# EAGLE board fpga (EAGLE 6.6.0)
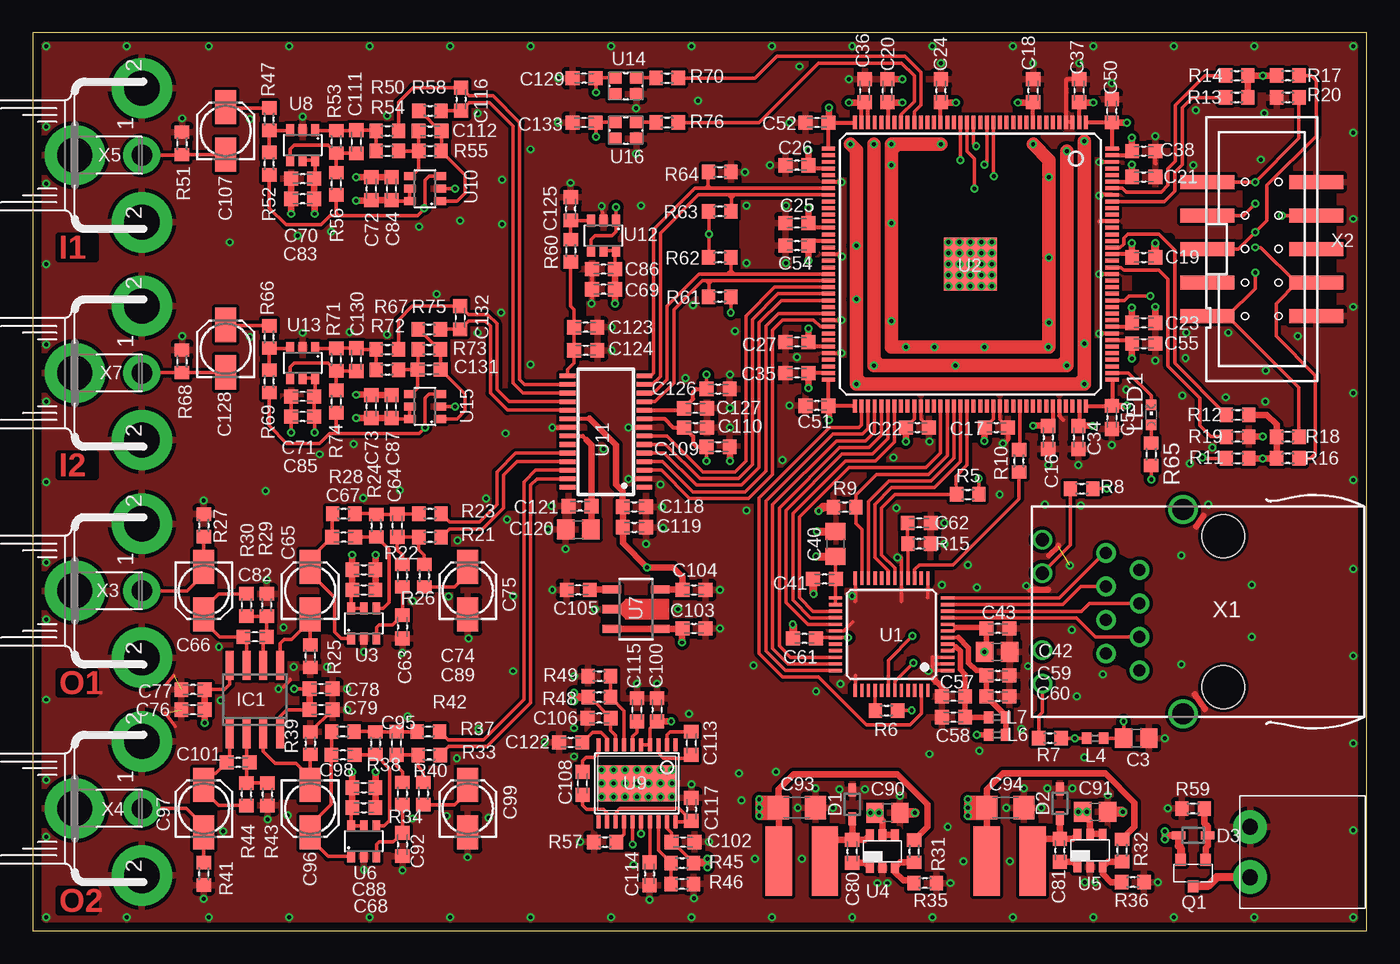
[diagram p2: board, top side]
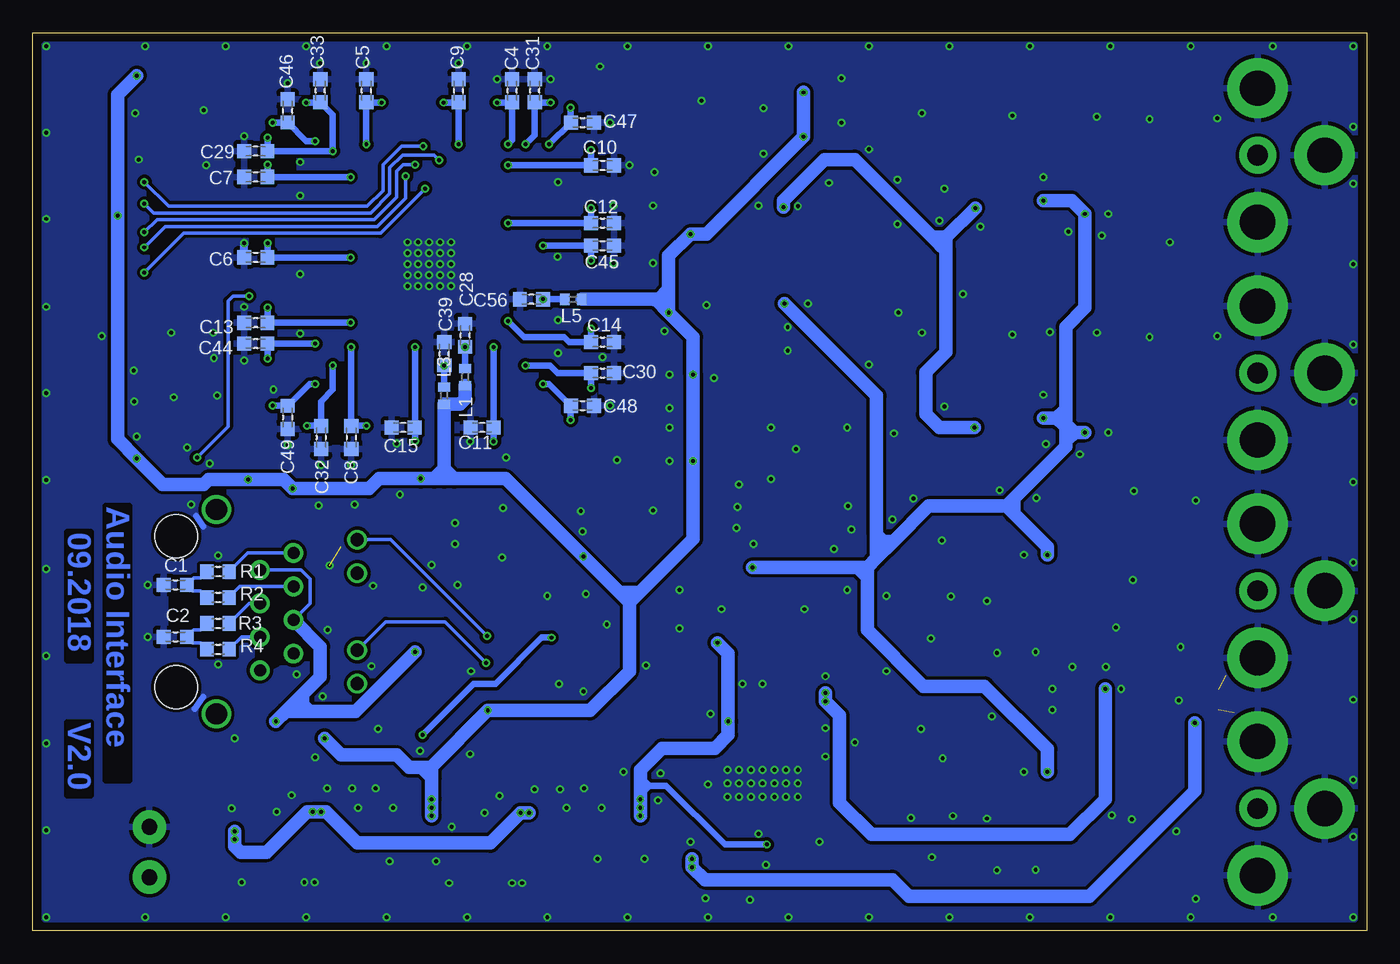
[diagram p3: board, bottom side, seen from below]

Size 101.09 x 68.07 mm. Coordinates in mm from the lower left corner, seen from the top.
Outline: 0,0 101.09,0 101.09,68.07 0,68.07 0,0
Copper layers (1*16): Top 0.035mm / dielectric 1.5mm / Bottom 0.035mm
Design rules "PCB-POOL Standard *": minimum track width 0.15mm, minimum drill 0.3mm, track to track 0.1mm, track to pad 0.1mm, pad to pad 0.1mm, via to via 0.1mm, smd to smd 0.1mm, copper to edge 0.2mm, drill to drill 0.2mm, minimum pad ring 0.2mm, minimum via ring 0.15mm, stop-mask expansion 0.075mm, vias tented up to drill 0.3mm, thermal gap 0.3mm
tRestrict: area 62.8,5.3 to 66,6.7; area 66.5,7.7 to 67.3,9.6; area 78.6,5.5 to 81.9,6.8; area 82.1,7.9 to 82.9,9.8; area 69,18.4 to 69.7,20.8; area 62.2,17.7 to 62.8,18.5; area 62.1,26.4 to 67.9,27.2; area 57.2,21.8 to 57.8,23.7; area 58.5,24.6 to 60.3,32.4; area 61.7,27.7 to 62.8,30.7; area 83.7,46.3 to 86.2,52.6; area 19.2,53.8 to 20.7,56.3; 33 more areas
bRestrict: area 77.4,37.2 to 78.8,41; area 88.8,23.2 to 90.4,25.3; area 83.4,51.6 to 84.3,52.6; area 81.5,57.7 to 82.4,58.7; area 81.3,19.7 to 83.9,22.3

## Footprints (pad centres in the part's own frame; a part is rotated, then mirrored left to right if it is on the bottom)
C0603K = smd 1.05 x 1.08: 1 -0.875,0; 2 0.875,0
C0805 = smd 1.3 x 1.5: 1 -0.95,0; 2 0.95,0
153CLV-0405 = smd 2.6 x 1.6: + 1.8,0; - -1.8,0
C1206 = smd 1.6 x 1.8: 1 -1.4,0; 2 1.4,0
SOD323 = smd 1 x 0.6: 1 -1.1,0; 2 1.1,0
SO08 = smd 0.6 x 2.2: 1 -1.905,-2.6; 2 -0.635,-2.6; 3 0.635,-2.6; 4 1.905,-2.6; 5 1.905,2.6; 6 0.635,2.6; 7 -0.635,2.6; 8 -1.905,2.6
0402 = smd 0.7 x 0.9: 1 -0.65,0; 2 0.65,0
AAA = smd 2 x 5.3: P$1 -2,1; P$2 1.5,1
CHIPLED_0603 = smd 0.8 x 0.8: A 0,-0.75; C 0,0.75
MICRO3 = smd 0.8 x 0.9: 1 -0.95,-1; 2 0.95,-1; 3 0,1
R0603 = smd 1 x 1.1: 1 -0.85,0; 2 0.85,0
TQFP48 = smd 0.25 x 1: 1 -2.75,-4.25; 2 -2.25,-4.25; 3 -1.75,-4.25; 4 -1.25,-4.25; 5 -0.75,-4.25; 6 -0.25,-4.25; 7 0.25,-4.25; 8 0.75,-4.25; 9 1.25,-4.25; 10 1.75,-4.25; 11 2.25,-4.25; 12 2.75,-4.25; 25 2.75,4.25; 26 2.25,4.25; 27 1.75,4.25; 28 1.25,4.25; 29 0.75,4.25; 30 0.25,4.25; 31 -0.25,4.25; 32 -0.75,4.25; 33 -1.25,4.25; 34 -1.75,4.25; 35 -2.25,4.25; 36 -2.75,4.25 | smd 1 x 0.25: 13 4.25,-2.75; 14 4.25,-2.25; 15 4.25,-1.75; 16 4.25,-1.25; 17 4.25,-0.75; 18 4.25,-0.25; 19 4.25,0.25; 20 4.25,0.75; 21 4.25,1.25; 22 4.25,1.75; 23 4.25,2.25; 24 4.25,2.75; 37 -4.25,2.75; 38 -4.25,2.25; 39 -4.25,1.75; 40 -4.25,1.25; 41 -4.25,0.75; 42 -4.25,0.25; 43 -4.25,-0.25; 44 -4.25,-0.75; 45 -4.25,-1.25; 46 -4.25,-1.75; 47 -4.25,-2.25; 48 -4.25,-2.75
EQFP144 = smd 1 x 0.3: 1 -10.75,8.75; 2 -10.75,8.25; 3 -10.75,7.75; 4 -10.75,7.25; 5 -10.75,6.75; 6 -10.75,6.25; 7 -10.75,5.75; 8 -10.75,5.25; 9 -10.75,4.75; 10 -10.75,4.25; 11 -10.75,3.75; 12 -10.75,3.25; 13 -10.75,2.75; 14 -10.75,2.25; 15 -10.75,1.75; 16 -10.75,1.25; 17 -10.75,0.75; 18 -10.75,0.25; 19 -10.75,-0.25; 20 -10.75,-0.75; 21 -10.75,-1.25; 22 -10.75,-1.75; 23 -10.75,-2.25; 24 -10.75,-2.75; 25 -10.75,-3.25; 26 -10.75,-3.75; 27 -10.75,-4.25; 28 -10.75,-4.75; 29 -10.75,-5.25; 30 -10.75,-5.75; 31 -10.75,-6.25; 32 -10.75,-6.75; 33 -10.75,-7.25; 34 -10.75,-7.75; 35 -10.75,-8.25; 36 -10.75,-8.75; 73 10.75,-8.75; 74 10.75,-8.25; 75 10.75,-7.75; 76 10.75,-7.25; 77 10.75,-6.75; 78 10.75,-6.25; 79 10.75,-5.75; 80 10.75,-5.25; 81 10.75,-4.75; 82 10.75,-4.25; 83 10.75,-3.75; 84 10.75,-3.25; 85 10.75,-2.75; 86 10.75,-2.25; 87 10.75,-1.75; 88 10.75,-1.25; 89 10.75,-0.75; 90 10.75,-0.25; 91 10.75,0.25; 92 10.75,0.75; 93 10.75,1.25; 94 10.75,1.75; 95 10.75,2.25; 96 10.75,2.75; 97 10.75,3.25; 98 10.75,3.75; 99 10.75,4.25; 100 10.75,4.75; 101 10.75,5.25; 102 10.75,5.75; 103 10.75,6.25; 104 10.75,6.75; 105 10.75,7.25; 106 10.75,7.75; 107 10.75,8.25; 108 10.75,8.75 | smd 0.3 x 1: 37 -8.75,-10.75; 38 -8.25,-10.75; 39 -7.75,-10.75; 40 -7.25,-10.75; 41 -6.75,-10.75; 42 -6.25,-10.75; 43 -5.75,-10.75; 44 -5.25,-10.75; 45 -4.75,-10.75; 46 -4.25,-10.75; 47 -3.75,-10.75; 48 -3.25,-10.75; 49 -2.75,-10.75; 50 -2.25,-10.75; 51 -1.75,-10.75; 52 -1.25,-10.75; 53 -0.75,-10.75; 54 -0.25,-10.75; 55 0.25,-10.75; 56 0.75,-10.75; 57 1.25,-10.75; 58 1.75,-10.75; 59 2.25,-10.75; 60 2.75,-10.75; 61 3.25,-10.75; 62 3.75,-10.75; 63 4.25,-10.75; 64 4.75,-10.75; 65 5.25,-10.75; 66 5.75,-10.75; 67 6.25,-10.75; 68 6.75,-10.75; 69 7.25,-10.75; 70 7.75,-10.75; 71 8.25,-10.75; 72 8.75,-10.75; 109 8.75,10.75; 110 8.25,10.75; 111 7.75,10.75; 112 7.25,10.75; 113 6.75,10.75; 114 6.25,10.75; 115 5.75,10.75; 116 5.25,10.75; 117 4.75,10.75; 118 4.25,10.75; 119 3.75,10.75; 120 3.25,10.75; 121 2.75,10.75; 122 2.25,10.75; 123 1.75,10.75; 124 1.25,10.75; 125 0.75,10.75; 126 0.25,10.75; 127 -0.25,10.75; 128 -0.75,10.75; 129 -1.25,10.75; 130 -1.75,10.75; 131 -2.25,10.75; 132 -2.75,10.75; 133 -3.25,10.75; 134 -3.75,10.75; 135 -4.25,10.75; 136 -4.75,10.75; 137 -5.25,10.75; 138 -5.75,10.75; 139 -6.25,10.75; 140 -6.75,10.75; 141 -7.25,10.75; 142 -7.75,10.75; 143 -8.25,10.75; 144 -8.75,10.75 | smd 4 x 4: E 0,0
SOT23-6 = smd 0.6 x 0.9: 1 -0.95,-1.15; 2 0,-1.15; 3 0.95,-1.15; 4 0.95,1.15; 5 0,1.15; 6 -0.95,1.15
TSOT23-6_DDC = smd 0.6 x 0.8: 1 -0.95,-1.25; 2 0,-1.25; 3 0.95,-1.25; 4 0.95,1.25; 5 0,1.25; 6 -0.95,1.25
SOT89-5 = smd 0.6 x 1.4: 1 -1.499,-1.781; 3 1.499,-1.781; 4 1.499,1.894; 5 -1.499,1.894 | smd 0.65 x 1.4: 2 0,-1.781
TSSOP20_GND = smd 0.305 x 0.991: 1 -2.925,-2.918; 2 -2.275,-2.918; 3 -1.625,-2.918; 4 -0.975,-2.918; 5 -0.325,-2.918; 6 0.325,-2.918; 7 0.975,-2.918; 8 1.625,-2.918; 9 2.275,-2.918; 10 2.925,-2.918; 11 2.925,2.918; 12 2.275,2.918; 13 1.625,2.918; 14 0.975,2.918; 15 0.325,2.918; 16 -0.325,2.918; 17 -0.975,2.918; 18 -1.625,2.918; 19 -2.275,2.918; 20 -2.925,2.918 | smd 6.071 x 2.743: GND 0,0
TSSOP28 = smd 0.35 x 1.2: 1 -4.225,-2.9; 2 -3.575,-2.9; 3 -2.925,-2.9; 4 -2.275,-2.9; 5 -1.625,-2.9; 6 -0.975,-2.9; 7 -0.325,-2.9; 8 0.325,-2.9; 9 0.975,-2.9; 10 1.625,-2.9; 11 2.275,-2.9; 12 2.925,-2.9; 13 3.575,-2.9; 14 4.225,-2.9; 15 4.225,2.9; 16 3.575,2.9; 17 2.925,2.9; 18 2.275,2.9; 19 1.625,2.9; 20 0.975,2.9; 21 0.325,2.9; 22 -0.325,2.9; 23 -0.975,2.9; 24 -1.625,2.9; 25 -2.275,2.9; 26 -2.925,2.9; 27 -3.575,2.9; 28 -4.225,2.9
OSC = smd 1 x 0.9: 1 0,0; 2 1.625,0; 3 1.625,1.225; 4 0,1.225
SI-50170 = drill 0.9 pad 1.5: 1 4.445,5.842; 2 3.175,3.302; 3 1.905,5.842; 4 0.635,3.302; 5 -0.635,5.842; 6 -1.905,3.302; 7 -3.175,5.842; 8 -4.445,3.302 | drill 1.016 pad 1.5: A1 -5.461,10.668; A2 2.921,10.668; C1 -2.921,10.668; C2 5.461,10.668 | drill 1.6 pad 2.2: S1 -7.747,0; S2 7.747,0 | hole 3.251: -5.715,-3.048; 5.715,-3.048
PAK100/2500-10 = smd 1.067 x 4.064: 1 -5.08,-4.128; 2 -5.08,4.128; 3 -2.54,-4.128; 4 -2.54,4.128; 5 0,-4.128; 6 0,4.128; 7 2.54,-4.128; 8 2.54,4.128; 9 5.08,-4.128; 10 5.08,4.128
RCA = drill 2.667 pad 4.572: GND1 -5.08,0; GND2 5.08,0; GND3 0,5.08 | drill 1.575 pad 2.794: S1 0,0
2 = drill 1.2 pad 2.54: P$1 -1.905,0; P$2 1.905,0

## Placement (x,y rotation side)
C1  100n  [C0603K]  90.3,26.23 0 bottom
C2  100n  [C0603K]  90.3,22.29 0 bottom
C3  10u  [C0805]  83.63,14.61 0 top
C4  100n  [C0603K]  64.77,63.69 90 bottom
C5  100n  [C0603K]  75.82,63.69 90 bottom
C6  100n  [C0603K]  84.2,51.05 180 bottom
C7  100n  [C0603K]  84.2,57.15 180 bottom
C8  100n  [C0603K]  76.96,37.4 270 bottom
C9  100n  [C0603K]  68.83,63.69 90 bottom
C10  100n  [C0603K]  57.91,58.04 0 bottom
C11  100n  [C0603K]  67.06,38.16 180 bottom
C12  100n  [C0603K]  57.91,53.66 0 bottom
C13  100n  [C0603K]  84.2,46.1 180 bottom
C14  100n  [C0603K]  57.91,44.64 0 bottom
C15  100n  [C0603K]  73.03,38.16 180 bottom
C16  1u  [C0603K]  76.96,37.4 270 top
C17  1u  [C0603K]  73.03,38.16 0 top
C18  1u  [C0603K]  75.82,63.69 90 top
C19  1u  [C0603K]  84.2,51.05 0 top
C20  1u  [C0603K]  64.77,63.69 90 top
C21  1u  [C0603K]  84.2,57.15 0 top
C22  1u  [C0603K]  67.06,38.16 0 top
C23  1u  [C0603K]  84.2,46.1 0 top
C24  1u  [C0603K]  68.83,63.69 90 top
C25  1u  [C0603K]  57.91,53.66 180 top
C26  1u  [C0603K]  57.91,58.04 180 top
C27  1u  [C0603K]  57.91,44.64 180 top
C28  10u  [C0603K]  68.33,45.15 90 bottom
C29  100n  [C0603K]  84.2,59.12 180 bottom
C30  100n  [C0603K]  57.91,42.29 0 bottom
C31  100n  [C0603K]  63.06,63.69 90 bottom
C32  100n  [C0603K]  79.25,37.4 270 bottom
C33  100n  [C0603K]  79.31,63.69 90 bottom
C34  1u  [C0603K]  79.25,37.4 270 top
C35  1u  [C0603K]  57.91,42.29 180 top
C36  1u  [C0603K]  63.06,63.69 90 top
C37  1u  [C0603K]  79.31,63.69 90 top
C38  1u  [C0603K]  84.2,59.12 0 top
C39  10u  [C0603K]  69.91,43.75 90 bottom
C40  47u  [C0805]  60.83,29.34 90 top
C41  100n  [C0603K]  60.01,26.67 180 top
C42  47u  [C0805]  73.09,21.15 180 top
C43  100n  [C0603K]  73.15,22.92 180 top
C44  100n  [C0603K]  84.2,44.51 180 bottom
C45  100n  [C0603K]  57.91,51.94 0 bottom
C46  100n  [C0603K]  81.79,62.17 90 bottom
C47  100n  [C0603K]  59.44,61.28 0 bottom
C48  100n  [C0603K]  59.44,39.81 0 bottom
C49  100n  [C0603K]  81.79,38.93 270 bottom
C50  1u  [C0603K]  81.79,62.17 90 top
C51  1u  [C0603K]  59.44,39.81 180 top
C52  1u  [C0603K]  59.44,61.28 180 top
C53  1u  [C0603K]  81.79,38.93 270 top
C54  1u  [C0603K]  57.91,51.94 180 top
C55  1u  [C0603K]  84.2,44.51 0 top
C56  10u  [C0603K]  63.31,47.88 180 bottom
C57  100n  [C0603K]  69.79,17.78 180 top
C58  100n  [C0603K]  69.79,16.19 180 top
C59  100n  [C0603K]  73.15,19.37 0 top
C60  1u  [C0603K]  73.15,17.78 0 top
C61  100n  [C0603K]  58.48,22.16 180 top
C62  100p  [C0603K]  67.18,30.92 180 top
C63  1.5n  [C0603K]  28,23.05 270 top
C64  2.7n  [C0603K]  27.62,30.73 90 top
C65  390n  [153CLV-0405]  21.02,25.78 90 top
C66  10u  [153CLV-0405]  12.95,25.78 270 top
C67  1.5n  [C0603K]  23.56,29.84 180 top
C68  1u  [C0603K]  25.08,10.86 0 top
C69  1u  [C0603K]  43.24,48.64 180 top
C70  1u  [C0603K]  20.45,57.02 180 top
C71  1u  [C0603K]  20.45,40.51 180 top
C72  1u  [C0603K]  25.65,56.26 90 top
C73  1u  [C0603K]  25.65,39.75 90 top
C74  1u  [C0603K]  25.08,27.37 0 top
C75  10u  [153CLV-0405]  32.96,25.78 90 top
C76  1u  [C0603K]  12.13,16.76 180 top
C77  100n  [C0603K]  12.13,18.29 180 top
C78  1u  [C0603K]  21.84,18.35 180 top
C79  100n  [C0603K]  21.84,16.76 180 top
C80  10n  [C0603K]  62.1,6.03 90 top
C81  10n  [C0603K]  77.85,6.1 90 top
C82  560p  [C0603K]  16.83,22.29 180 top
C83  100n  [C0603K]  20.45,55.5 180 top
C84  100n  [C0603K]  27.18,56.26 90 top
C85  100n  [C0603K]  20.45,38.99 180 top
C86  100n  [C0603K]  43.24,50.16 180 top
C87  100n  [C0603K]  27.18,39.75 90 top
C88  100n  [C0603K]  25.08,9.33 0 top
C89  100n  [C0603K]  25.08,25.84 0 top
C90  10u  [C0805]  64.77,8.95 0 top
C91  10u  [C0805]  80.52,9.02 0 top
C92  1.5n  [C0603K]  28,6.54 270 top
C93  22u  [C1206]  57.91,9.33 0 top
C94  22u  [C1206]  73.72,9.33 0 top
C95  2.7n  [C0603K]  27.56,14.22 90 top
C96  390n  [153CLV-0405]  21.02,9.27 270 top
C97  10u  [153CLV-0405]  12.95,9.27 90 top
C98  1.5n  [C0603K]  23.5,13.33 180 top
C99  10u  [153CLV-0405]  32.96,9.27 90 top
C100  10u  [C0603K]  47.31,16.76 270 top
C101  560p  [C0603K]  15.56,12.76 180 top
C102  10u  [C0603K]  49.28,6.73 0 top
C103  220n  [C0603K]  50.1,22.92 0 top
C104  220n  [C0603K]  50.1,25.84 0 top
C105  100n  [C0603K]  41.34,25.84 180 top
C106  10u  [C0603K]  42.93,16.13 180 top
C107  1u  [153CLV-0405]  14.61,60.64 90 top
C108  1u  [C0603K]  41.66,11.18 90 top
C109  1u  [C0603K]  51.94,36.7 0 top
C110  100n  [C0603K]  50.23,38.16 0 top
C111  560p  [C0603K]  24.51,59.82 270 top
C112  100p  [C0603K]  30.1,60.64 0 top
C113  1u  [C0603K]  49.91,14.22 90 top
C114  100n  [C0603K]  46.74,4.32 270 top
C115  100n  [C0603K]  45.78,16.76 90 top
C116  2.7n  [C0603K]  32.45,63.06 270 top
C117  10u  [C0603K]  49.91,9.21 270 top
C118  100n  [C0603K]  45.59,32.14 0 top
C119  1u  [C0603K]  45.59,30.59 0 top
C120  47u  [C0805]  41.34,30.42 180 top
C121  100n  [C0603K]  41.47,32.19 180 top
C122  10u  [C0603K]  40.77,14.29 0 top
C123  1u  [C0603K]  41.9,45.76 180 top
C124  100n  [C0603K]  41.9,44.01 180 top
C125  100n  [C0603K]  40.77,54.74 90 top
C126  1u  [C0603K]  51.94,41.08 0 top
C127  0.1u  [C0603K]  50.23,39.62 0 top
C128  1u  [153CLV-0405]  14.61,44.13 90 top
C129  100n  [C0603K]  41.78,64.64 180 top
C130  560p  [C0603K]  24.51,43.31 270 top
C131  100p  [C0603K]  30.04,42.55 0 top
C132  2.7n  [C0603K]  32.38,46.48 270 top
C133  100n  [C0603K]  41.78,61.28 180 top
D1  PMEG4010CEJ  [SOD323]  62.1,9.59 90 top
D2  PMEG4010CEJ  [SOD323]  77.85,9.65 90 top
D3  6V  [SOD323]  87.95,7.24 0 top
IC1  LM4562  [SO08]  16.83,17.53 0 top
L1  BLM15HB121SN1  [0402]  68.33,41.97 270 bottom
L3  BLM15HB121SN1  [0402]  69.91,40.58 270 bottom
L4  BLM15HB121SN1  [0402]  80.52,14.61 180 top
L5  BLM15HB121SN1  [0402]  60.13,47.88 0 bottom
L6  BLM15HB121SN1  [0402]  73.09,14.86 180 top
L7  BLM15HB121SN1  [0402]  73.09,16.19 0 top
L8  10u  [AAA]  58.04,6.29 180 top
L9  10u  [AAA]  73.79,6.29 180 top
LED1  [CHIPLED_0603]  84.77,39.12 0 top
Q1  DMP2035U  [MICRO3]  87.95,4.38 180 top
R1  49.9  [R0603]  87.06,27.24 0 bottom
R2  49.9  [R0603]  87.06,25.27 0 bottom
R3  49.9  [R0603]  87.06,23.3 0 bottom
R4  49.9  [R0603]  87.06,21.34 0 bottom
R5  4.7k  [R0603]  70.87,33.08 0 top
R6  10k  [R0603]  64.71,16.7 0 top
R7  560  [R0603]  77.09,14.61 0 top
R8  560  [R0603]  79.5,33.53 0 top
R9  10k  [R0603]  61.53,32.13 0 top
R10  22  [R0603]  74.74,35.62 90 top
R11  10k  [R0603]  91.31,35.81 0 top
R12  10k  [R0603]  91.31,39.12 0 top
R13  10k  [R0603]  91.25,63.18 0 top
R14  10k  [R0603]  91.25,64.83 0 top
R15  6.49k  [R0603]  67.18,29.34 180 top
R16  10k  [R0603]  95.12,35.81 180 top
R17  10k  [R0603]  95.12,64.83 180 top
R18  10k  [R0603]  95.12,37.46 180 top
R19  10k  [R0603]  91.31,37.46 180 top
R20  1k  [R0603]  95.12,63.18 0 top
R21  4.7k  [R0603]  30.1,29.84 180 top
R22  1.5k  [R0603]  28,26.92 270 top
R23  4.7k  [R0603]  30.1,31.62 180 top
R24  1.5k  [R0603]  26.02,30.72 270 top
R25  100k  [R0603]  21.02,20.83 90 top
R26  2k  [R0603]  29.65,26.92 270 top
R27  100k  [R0603]  12.95,30.73 270 top
R28  2k  [R0603]  23.56,31.62 180 top
R29  1.3k  [R0603]  17.72,24.7 270 top
R30  3.9k  [R0603]  16.19,24.7 270 top
R31  7.5k  [R0603]  66.8,6.03 90 top
R32  3.09k  [R0603]  82.55,6.1 90 top
R33  4.7k  [R0603]  30.04,13.33 180 top
R34  1.5k  [R0603]  28,10.41 270 top
R35  1k  [R0603]  67.63,3.62 180 top
R36  1k  [R0603]  83.38,3.68 180 top
R37  4.7k  [R0603]  29.97,15.11 180 top
R38  1.5k  [R0603]  25.97,14.22 270 top
R39  100k  [R0603]  21.02,14.22 270 top
R40  2k  [R0603]  29.59,10.41 270 top
R41  100k  [R0603]  12.95,4.32 90 top
R42  2k  [R0603]  23.5,15.11 180 top
R43  1.3k  [R0603]  17.78,10.35 90 top
R44  3.9k  [R0603]  16.19,10.35 90 top
R45  56k  [R0603]  49.21,5.14 0 top
R46  10k  [R0603]  49.21,3.56 180 top
R47  30k  [R0603]  17.91,61.53 90 top
R48  56k  [R0603]  42.93,17.72 180 top
R49  10k  [R0603]  42.93,19.3 0 top
R50  100  [R0603]  26.86,60.64 0 top
R51  10k  [R0603]  11.3,59.69 270 top
R52  10k  [R0603]  17.91,58.17 90 top
R53  3.9k  [R0603]  22.99,59.82 90 top
R54  10k  [R0603]  26.86,59.12 0 top
R55  10k  [R0603]  30.1,59.12 0 top
R56  10k  [R0603]  22.99,56.64 90 top
R57  220k  [R0603]  43.37,6.73 0 top
R58  100  [R0603]  30.1,62.17 0 top
R59  100k  [R0603]  87.95,9.27 180 top
R60  10k  [R0603]  40.77,51.56 270 top
R61  2k  [R0603]  52.07,48.07 0 top
R62  2k  [R0603]  52.07,51.05 180 top
R63  10k  [R0603]  52.07,54.55 180 top
R64  10k  [R0603]  52.07,57.53 0 top
R65  560  [R0603]  84.77,36.13 270 top
R66  30k  [R0603]  17.91,45.02 90 top
R67  100  [R0603]  26.86,44.07 0 top
R68  10k  [R0603]  11.3,43.18 270 top
R69  10k  [R0603]  17.91,41.66 90 top
R70  22  [R0603]  48.07,64.64 0 top
R71  3.9k  [R0603]  22.99,43.31 90 top
R72  10k  [R0603]  26.86,42.55 0 top
R73  10k  [R0603]  30.04,44.07 0 top
R74  10k  [R0603]  22.99,40.13 90 top
R75  100  [R0603]  30.04,45.59 0 top
R76  22  [R0603]  48.07,61.28 0 top
U1  KSZ8041TL  [TQFP48]  65.09,22.48 90 top
U2  10M16SAE144  [EQFP144]  71.06,50.55 270 top
U3  OPA625  [SOT23-6]  25.08,23.3 0 top
U4  AP3211  [TSOT23-6_DDC]  64.39,6.03 0 top
U5  AP3211  [TSOT23-6_DDC]  80.14,6.1 0 top
U6  OPA625  [SOT23-6]  25.08,6.79 0 top
U7  AP1152  [SOT89-5]  45.66,24.38 270 top
U8  OPA625  [SOT23-6]  20.45,59.56 180 top
U9  LTC3265  [TSSOP20_GND]  45.78,11.18 180 top
U10  OPA625  [SOT23-6]  29.72,56.26 90 top
U11  CS4272  [TSSOP28]  43.43,37.85 90 top
U12  OPA625  [SOT23-6]  43.24,52.7 180 top
U13  OPA625  [SOT23-6]  20.45,43.05 180 top
U14  49.152MHz  [OSC]  44.13,63.44 0 top
U15  OPA625  [SOT23-6]  29.72,39.75 90 top
U16  50MHz  [OSC]  44.13,60.07 0 top
X1  SI-50170  [SI-50170]  87.19,24.19 90 top
X2  2510-  [PAK100/2500-10]  93.15,51.69 270 top
X3  RCA  [RCA]  8.26,25.78 90 top
X4  RCA  [RCA]  8.26,9.27 90 top
X5  RCA  [RCA]  8.26,58.8 90 top
X6  2  [2]  92.27,5.97 90 top
X7  RCA  [RCA]  8.26,42.29 90 top

## Tracks (layer width: path | path; a pad name or v marks a point on that pad's centre or on a via)
+3V3_D  (via drill 0.3)
  Top 0.254: 60.59,26.8 C41.1 | U1.26 U1.25 60.83,26.62 C41.1 | C129.1 42.67,64.65 | U16.4 42.68,61.3 C133.1 42.67,61.26 v42.67,60.2 | U14.4 42.68,64.66 C129.1 | C129.1 42.67,64.63 v42.67,63.56 | v51.05,42.16 51.07,41.71 C126.1 | v51.05,35.62 51.05,36.69 C109.1 | R6.2 v66.61,16.7 | v59.38,28.39 v59.37,28.38 | C40.1 60.83,26.72 C41.1 | L4.2 v78.99,14.61 R7.2 | R61.2 52.9,47.92 v52.9,46.86 | R63.2 51.24,54.39 v51.24,52.83 51.24,51.27 R62.2 | v71.69,34.29 71.69,33.11 R5.2 | R8.2 v81.41,33.53 | X2.4 v94.68,54.23 | R65.2 v84.77,34.23
  Top 0.305: U11.10 49.2,39.47 C127.1 49.35,39.64 50.04,40.32 50.04,40.83 50.29,41.08 C126.1 | U11.9 47.86,38.82 48.51,38.16 C110.1 50.04,37.48 50.04,36.96 50.29,36.7 C109.1
  Top 0.406: 72.32,5.32 L9.P$2
  Top 0.508: L9.P$2 72.33,5.25 72.33,4.51 72.32,4.51 C94.1 72.32,10.73 73.53,11.94 81.28,11.94 83.5,9.71 83.5,7.9 R32.2 | R11.2 v93.22,35.81 R16.2 R18.2 94.27,38.38 93.54,39.12 R12.2 | R17.2 v93.22,64.83 R14.2 R13.2
  Top 0.61: v70.87,9.97 72.32,9.97 C94.1 72.32,8.7 v70.87,8.7 | v70.87,9.97 v70.87,9.33 | v70.87,9.97 v70.87,8.7 | v70.87,8.7 71.37,8.7 71.37,9.78 | v59.38,28.39 C40.1
  Bottom 0.254: 71.37,34.61 v71.69,34.29
  Bottom 1.016: 70.87,11.62 v70.87,9.97 v70.87,8.7 | 70.87,11.62 70.87,12.45 | 70.87,12.45 v66.61,16.7 58.86,16.7 55.88,19.68 55.88,24.89 | 55.88,24.89 v59.37,28.38 65.28,34.29 69.15,34.29 | 55.88,24.89 51.05,29.72 v51.05,35.62 v51.05,42.16 51.05,45.02 v52.9,46.86 | 52.9,48.64 52.9,51.18 v51.24,52.83 50.04,52.83 v42.67,60.2 v42.67,63.56 | 52.9,48.64 v52.9,46.86 | 69.15,34.29 69.91,34.29 | 69.91,34.29 70.67,34.29 | 70.67,34.29 v71.69,34.29 74.87,34.29 75.63,33.53 v81.41,33.53 82.11,34.23 v84.77,34.23 87.76,34.23 88.14,33.85 91.25,33.85 v93.22,35.81 94.68,37.27 v94.68,54.23 94.68,63.37 v93.22,64.83 | L5.2 53.91,47.88 v52.9,46.86 | L1.2 68.33,40.32 68.72,39.93 L3.2 69.91,35.05 | 69.91,35.05 69.91,34.29 | v78.99,14.61 77.72,13.33 73.53,13.33 72.58,12.38 71.63,12.38 | 53.91,47.82 53.72,47.82 52.9,48.64 | 69.15,34.29 69.91,35.05 | 69.91,35.05 70.67,34.29 | 71.63,12.38 70.93,12.38 70.87,12.45 | 71.63,12.38 70.87,11.62
+5V  (via drill 0.3 pad 0.3)
  Top 0.254: U6.5 U6.6 24.13,9.26 | U3.5 U3.6 24.13,25.77 | U8.5 U8.6 21.4,57.1 | U10.5 U10.6 27.25,55.31 | U13.5 U13.6 21.4,40.59 | U15.5 U15.6 27.25,38.8 | U12.5 U12.6 44.12,51.48 C86.1 | v21.34,37.78 21.34,38.98 C85.1 C71.1
  Top 0.305: U11.20 42.2,38.82
  Top 0.508: 21.4,57.1 C70.1 C83.1 21.34,55.48 v21.34,54.36 | 21.4,40.59 C71.1 | 27.28,38.93 C87.1 | 25.68,39.05 C73.1 | 44.19,50.24 C86.1 C69.1 44.13,48.63 v44.13,47.56 | 27.25,38.8 C87.1 | 24.13,25.77 C89.1 C74.1 24.19,27.38 v24.19,28.51 | 24.13,9.26 C88.1 C68.1 24.19,10.87 v24.19,12.06 | 27.25,55.31 C84.1 C72.1 v24.51,55.37 | U7.5 49.19,25.88 C104.1 49.23,26.85 48.51,27.56 v46.54,27.56 44.71,29.39 C119.1 C118.1 44.7,32.15 44.7,33.34 44.2,33.85 44.2,36.83 42.2,38.82 | v24.51,38.86 C73.1 | C73.1 C87.1
  Bottom 1.016: v24.19,12.06 24.19,13.78 28.96,18.54 33.59,18.54 37.85,22.8 37.85,26.8 | v24.19,28.51 24.19,29.08 26.73,31.62 | 26.73,31.62 27.3,32.19 | 27.3,32.19 33.21,32.19 35.88,29.53 | 35.88,29.53 37.15,28.26 | v24.51,55.37 22.35,55.37 v21.34,54.36 21.34,47.24 22.8,45.78 22.8,38.61 | 22.8,38.61 22.8,37.78 | 26.73,32.77 22.8,36.7 22.8,37.78 | 26.73,32.77 27.3,32.19 | v24.51,38.86 23.5,38.86 | 23.5,38.86 23.05,38.86 22.8,38.61 | 22.8,37.78 22.16,37.78 | 22.16,37.78 v21.34,37.78 | 37.15,30.04 37.15,28.26 | 37.15,28.26 37.85,27.56 | 37.85,27.56 38.61,27.56 | 38.61,27.56 v46.54,27.56 | 37.85,26.8 37.85,27.56 | 26.73,31.62 26.73,32.77 | 22.16,37.78 22.67,37.27 | 23.5,38.86 22.92,38.29 | 23.5,38.86 22.86,39.5 | 38.61,27.56 37.85,26.8 | 35.88,29.53 36.64,29.53 37.15,30.04 | 37.15,30.04 37.15,40.58 v44.13,47.56
+12V  (via drill 0.3 pad 0.6)
  Top 0.254: R45.2 48.47,6.73 C102.1 48.4,7.42 48.06,7.76 U9.19 | IC1.8 14.92,18.67 14.54,18.29 C77.1
  Top 0.508: v13.02,15.75 13.02,18.3 C77.1 C76.1
  Top 0.61: v51.12,5.46 v51.12,4.83 51.12,5.14 R45.2
  Bottom 1.016: v13.02,15.75 13.02,10.6 21.02,2.6 34.67,2.6 35.94,3.87 50.16,3.87 v51.12,4.83 v51.12,5.46
-12V  (via drill 0.3 pad 0.6)
  Top 0.254: IC1.4 18.73,16.26 19.24,16.76 C79.2 | v19.81,18.35 C78.2 | U9.8 44.16,14.83 43.8,15.19 C106.1 42.21,17.72 R48.2
  Top 0.508: C78.2 C79.2
  Top 0.61: v41.02,18.03 v41.02,17.4 41.02,17.72 R48.2
  Bottom 1.016: v19.81,18.35 19.81,9.97 22.48,7.3 37.53,7.3 39.94,9.71 39.94,16.32 v41.02,17.4 v41.02,18.03
GND  (via drill 0.3, 0.3 pad 0.3)  (3 unrouted)
  Top 0.254: 46.11,10.85 U9.GND | U9.16 46.11,7.49 v46.1,7.37 | C83.2 19.56,55.5 | v19.56,37.78 19.56,38.98 C85.2 C71.2 | C86.2 C69.2 42.37,47.51 v42.35,47.56 | v43.12,54.93 U12.2 | v65.53,28.32 65.85,28.32 65.84,28.02 U1.17 65.85,24.95 | U1.30 61.46,22.73 62.17,23.43 | U2.83 67.31,38.79 C11.2 | U2.95 73.31,38.76 C15.2 | R39.1 22.71,16.76 C79.1 | U1.3 68.2,20.73 | 68.2,20.73 68.2,20.76 | U1.2 68.2,20.23 | 68.2,20.23 68.2,20.73 | U1.1 68.2,19.73 68.2,20.23 | U1.37 62.34,19.37 62.36,19.37 | U1.13 67.84,25.27 67.82,25.27 | U1.24 62.34,24.95 62.29,24.95 | 57.59,22.16 C61.2 | U10.2 v32,56.26 | U15.2 v32,39.75 | 19.5,19.05 19.5,18.99 18.99,18.48 | 10.03,16.51 10.79,15.49 | 10.67,19.37 10.1,18.67
  Top 0.305: v39.37,38.16 U11.21 | U11.8 | v45.15,38.16 46.29,38.16 | U2.104 77.81,39.03 78.11,38.73 | U2.3 U2.4 78.31,64.57 C33.2 | 85.09,58.17 85.09,59.1 C38.2 | U2.42 61.28,56.8 v61.28,56.77 | U2.63 v61.27,46.3 v61.28,46.29 | U2.68 61.26,43.8 v61.28,43.81 | U2.53 61.16,51.3 v61.34,51.12 | U2.142 v80.84,58.29 | U2.137 80.88,55.8 v80.84,55.75 | U2.133 80.85,53.8 80.84,53.78 | U2.116 80.86,45.3 v80.84,45.28 | U2.125 80.85,49.8 v80.84,49.78 | C15.2 73.9,37.2 73.66,36.96
  Top 0.356: v45.15,34.26 v45.16,34.27 U11.2 | U11.8 v45.15,38.17 v45.15,38.16
  Top 0.406: 77.72,29.21 77.72,29.15 77.03,28.45
  Top 0.457: 76.96,25.84 75.63,25.84 v75.31,26.16
  Top 0.508: 25.68,40.8 C73.2 | 68.9,18.16 68.9,18.48 68.26,19.11 | C4.2 65.9,64.57 v65.91,64.58 | v52.83,35.62 52.83,36.64 | v85.09,47.31 C13.2 | R19.1 v93.22,37.46 | v24.51,40.64 25.64,40.64 C73.2 | C73.2 C87.2 | v24.51,57.15 25.64,57.15 C72.2 C84.2 | v19.56,54.36 19.56,55.48 C83.2 C70.2 | v25.97,28.51 25.97,27.38 C74.2 C89.2 | v25.97,12.06 25.97,10.87 C68.2 C88.2 | 88.71,31.43 88.2,30.67 | 88.84,16.83 88.07,17.91
  Top 0.61: v59.44,30.29 C40.2 | v59.18,25.53 59.18,26.62 C41.2 | v57.59,23.24 57.59,22.18 C61.2 | C6.2 85.08,52.12 v85.09,52.13
  Top 0.66: v59.56,31.81 59.88,32.13 R9.1
  Top 0.711: v66.87,8.95 C90.2
  Top 0.762: v82.61,9.02 C91.2
  Bottom 0.508: 88.71,31.43 88.2,30.67 | 88.2,17.72 88.84,16.83
  Bottom 0.61: C6.2 85.08,52.12 v85.09,52.13
  other vias: 20.45,45.34 20.45,61.72 1.02,50.55 31.62,67.06 25.53,67.06 19.43,67.06 13.34,67.06 1.02,67.06 7.11,67.06 1.02,34.04 1.02,44.45 1.02,40.13 1.02,60.96 1.02,23.62 1.02,11.43 1.02,56.64 1.02,27.94 1.02,7.11 1.02,17.53 25.08,21.15 31.62,1.02 25.53,1.02 19.43,1.02 13.34,1.02 1.02,1.02 7.11,1.02 43.81,1.02 37.72,1.02 37.72,67.06 49.91,1.02 39.05,30.42 47.69,32.13 46.48,29.34 39.31,32.19 40.39,28.96 47.75,30.54 65.72,10.22 60.64,9.33 59.31,10.79 61.15,10.73 63.06,10.73 57.98,9.33 64.01,3.62 64.77,3.62 56.01,1.02 100.08,1.02 11.3,61.59 11.3,45.09 52.83,38.16 52.83,39.62 49.47,41.91 53.21,45.47 57.09,54.99 69.09,29.34 70.87,27.75 25.08,4.64 43.12,10.16 43.12,12.19 48.45,10.16 48.45,12.19 48.89,24.38 42.61,24.38 73.53,36.96 61.21,18.73 93.34,61.98 81.47,10.29 78.8,10.79 76.9,10.79 76.45,9.33 75.12,10.79 73.79,9.33 79.76,3.68 80.52,3.68 65.21,35.88 90.42,40.45 57.91,43.5 69.41,52.2 72.71,52.2 72.71,48.89 69.41,48.89 28,4.57 32.96,5.59 28,21.08 33.02,22.16 17.72,26.61 17.78,8.45 12.95,2.41 12.95,32.64 23.81,18.35 23.81,16.76 49.91,11.11 51.24,6.73 41.47,6.73 38.8,14.29 41.02,19.3 45.78,18.73 47.31,18.73 41.02,15.37 40.77,56.71 43.88,45.78 43.88,44.01 39.81,61.28 39.81,64.64 53.97,57.53 57.09,50.61 46.74,2.35 50.1,2.48 69.53,3.62 85.28,3.68 86.04,9.27 52.83,42.16 70.23,52.2 71.06,52.2 71.88,52.2 70.23,51.37 69.41,51.37 69.41,50.55 69.41,49.72 71.06,51.37 71.88,51.37 72.71,51.37 70.23,50.55 71.06,50.55 71.88,50.55 72.71,50.55 70.23,49.72 71.06,49.72 71.88,49.72 72.71,49.72 70.23,48.89 71.06,48.89 71.88,48.89 44.89,12.19 46.67,12.19 44.89,10.16 46.67,10.16 69.09,30.92 62.1,1.02 68.2,1.02 74.3,1.02 80.39,1.02 86.49,1.02 92.58,1.02 56.01,67.06 49.91,67.06 43.81,67.06 62.1,67.06 68.2,67.06 74.3,67.06 100.08,67.06 86.49,67.06 80.39,67.06 92.58,67.06 100.08,60.52 100.08,53.98 100.08,47.31 100.08,40.77 100.08,34.16 100.08,27.43 100.08,20.83 100.08,14.22 100.08,7.62 39.37,25.84 52.07,25.84 52.07,22.92 85.79,14.61 68.9,26.23 62.1,25.4 67.88,19.68 85.09,43.24 32.19,29.59 32.13,13.08 31.37,8.7 28.77,8.51 28.77,25.02 31.5,25.34 14.22,17.46 18.61,18.35 18.99,22.99 19.3,8.76 43.24,36.51 58.1,65.53 50.42,62.93 61.85,64.58 88.14,62.23 87.95,58.04 93.09,58.48 87.44,45.34 87.38,43.43 93.41,40.13 90.61,45.34 93.47,42.48 87.69,35.43 82.87,41.02 76.96,35.31 79.25,35.31 81.79,36.83 73.28,33.08 56.83,35.69 16.45,61.53 16.45,45.02 24.32,36.89 33.72,45.34 35.5,46.86 30.61,48.26 35.56,53.59 32.38,53.85 33.72,61.98 37.72,59.25 26.86,61.79 29.27,53.4 22.61,53.02 24,45.4 26.86,45.21 35.56,56.96 20.07,52.7 34.35,32.77 27.81,33.4 35.81,37.72 21.72,36.13 25.02,32.83 36.39,25.4 36.39,19.68 28.38,16.26 33.78,15.3 45.53,5.02 41.02,13.21 14.41,7.56 14.1,21.53 17.65,33.34 14.92,52.2 35.94,31.18 50.04,47.43 65.47,32.07 78.61,27.69 79.44,32.26 76.71,32.32 74.93,15.3 79.12,17.78 78.74,22.8 75.44,20.07 81.09,19.43 92.39,26.23 92.39,22.29 87.06,28.45 89.09,32.32 57.34,39.81 55.88,58.04 57.34,61.28 68.83,65.79 75.82,65.79 79.31,65.79 81.79,64.26 85.09,60.26 95.89,45.09 69.34,7.87 54.1,31.88 49.72,16.45 56.32,12.06 53.53,11.94 79.69,13.14 67.95,13.4 54.61,20.13 34.54,8.57 54.1,54.99 46.1,54.99 45.72,58.93 45.72,62.36 71.56,26.03 89.41,36.64 87.12,40.58 37.72,42.93 59.37,18.16 53.72,9.91 58.29,5.46 54.74,5.46 74.04,5.27 70.55,5.27 71.76,13.65 54.1,50.61 67.95,37.08 43.12,11.18 44.01,12.19 45.78,12.19 47.56,12.19 47.56,10.16 45.78,10.16 44.01,10.16 44.01,11.18 44.89,11.18 45.78,11.18 46.67,11.18 47.56,11.18 48.45,11.18 87.06,20.19 22.29,20 19.75,20 47.56,33.85
  pour Top (isolate 0.254): 0.89,67.18 100.2,67.18 100.2,0.89 0.89,0.89
  pour Bottom (isolate 0.254): 0.89,67.18 100.2,67.18 100.2,0.89 0.89,0.89
N$1
  Top 0.254: C115.1 45.78,15.05 45.46,14.72 U9.6
N$2
  Top 0.254: 19.45,44.16 17.91,44.16 | 17.91,44.16 R66.1 | 17.91,44.16 R69.2
  Top 0.508: 19.45,44.16 U13.3
N$3
  Top 0.254: 30.71,44.07 R73.2 30.91,44.04 30.91,43.96 | U15.1 32.13,38.8 32.77,39.43 32.77,40.69 C131.2 30.91,43.56 30.91,43.96 | R75.1 29.27,45.59 30.91,43.96
N$4
  Top 0.305: U11.22 41.66,37.52 41.97,37.21
  Top 0.508: 42.35,30.6 C120.1 42.34,30.47 C121.1 | C121.1 | C121.1 42.34,36.84 41.97,37.21
N$5
  Top 0.254: C131.1 29.16,41.16 28.7,40.7 U15.4 | C131.1 29.19,42.57 R73.1 | R72.2 C131.1
N$6
  Top 0.254: U12.3 42.29,53.86 C125.1 R60.1
  Top 0.508: 40.96,53.85 C125.1
N$7
  Top 0.254: R34.1 28,12.06 27.56,12.51 C95.1 29.17,13.35 R33.2 29.19,12.47 29.59,12.06 R40.1
N$8
  Top 0.254: U11.18 36.08,40.12 35.18,41.02 35.18,46.04 34.48,46.74 33.01,46.74 C132.1 28.75,47.36 27.71,46.32 R67.2
N$9
  Top 0.254: R75.2 30.9,45.61 C132.2 33.01,46.23 34.29,46.23 34.67,45.85 34.67,40.77 35.97,39.47 U11.19
N$10
  Top 0.254: 21.44,60.67 R53.2 24.49,60.67 C111.1 25.96,60.69 R50.1 R54.1
  Top 0.508: 21.44,60.67 U8.1
N$11  (via drill 0.3 pad 0.6)
  Top 0.305: 82.92,39.8 v82.93,39.81 | 82.23,59.3 U2.144 81.81,61.27 C50.1 U2.1 | U2.115 83.04,44.8 C55.1 | 81.82,41.78 U2.109 81.81,39.82 C53.1 U2.108 | U2.36 62.29,61.28 C52.1 U2.37 | U2.72 C51.1 60.33,39.8 U2.73 | U2.51 59.14,52.3 C54.1
  Top 0.508: v82.93,61.28 81.8,61.28 C50.1 | v83.31,43.37 83.31,44.5 C55.1 | 82.92,39.8 C53.1 | v60.32,38.73 60.32,39.8 C51.1 | v58.8,50.8 58.8,51.93 C54.1 | v60.32,62.42 60.32,61.29 C52.1
  Top 1.016: v79.69,59.88 v79.69,44.51 v79.69,41.46 v62.42,41.46 v62.42,47.88 v62.42,51.94 62.42,59.18 v61.98,59.63
  Bottom 0.305: 82.92,39.8 v82.93,39.81 | C51.1 60.32,39.8 | 60.32,61.34 60.32,61.29
  Bottom 0.406: 60.32,61.34 60.32,61.28 | 60.32,39.81 C51.1 | 81.79,39.81 C53.1 | 81.79,61.28 C50.1
  Bottom 0.508: v79.69,44.51 C55.1 83.31,44.5 v83.31,43.37 | v62.42,41.46 61.96,41.46 60.32,39.83 | 60.32,39.83 C51.1 | v62.42,51.94 C54.1 v58.8,50.8 | v61.98,59.63 61.96,59.63 C52.1 60.32,61.29 v60.32,62.42 | v82.93,61.28 81.8,61.28 C50.1 80.38,59.88 v79.69,59.88 | v82.93,39.81 81.8,39.81 C53.1 80.12,41.46 v79.69,41.46 | v60.32,38.73 60.32,39.83 | L5.1 C56.1 v62.42,47.88
N$12
  Top 0.254: R42.1 25.93,15.11 R38.1 27.53,15.07 C95.2 29.11,15.1 R37.2
N$13
  Top 0.254: X5.S1 11.26,58.8 arc90 R51.2 C107.- arc90 C107.-
N$14
  Top 0.254: X7.S1 8.29,42.33 R68.2 C128.-
N$15
  Top 0.254: R34.2 C92.1 27.57,6.99 27.56,6.99 27.3,6.73 26.23,6.73 26.03,6.54 U6.3
N$16
  Top 0.254: U6.4 26.61,7.94 27.05,8.38 27.05,12.29 R38.2 25.93,13.33 C98.1
N$17
  Top 0.254: R42.2 22.64,13.36 C98.2 22.61,13.32 22.61,9.59 21.65,8.64 21.65,8.11 C96.+ 21.02,6.99 22.36,5.65 U6.1
N$18
  Top 0.254: R41.2 C97.- 12.95,7.94 11.62,9.27 X4.S1
N$19
  Top 0.254: C99.+ 32.96,10.54 31.98,9.56 R40.2
N$20
  Top 0.254: R26.2 31.98,26.07 32.96,27.05 C75.+
N$21
  Top 0.254: R14.1 88.84,64.83 86.61,62.61 86.61,58.36 86.04,57.78 86.04,56.52 85.54,56.01 82.87,56.01 82.58,56.3 U2.138
N$22
  Top 0.254: U14.3 47.2,64.66 R70.1
N$23
  Top 0.254: U2.136 85.78,55.3 86.55,56.07 86.55,57.53 87.12,58.1 87.12,62.42 87.88,63.18 R13.1
N$24
  Top 0.254: R37.1 31.46,14.48 34.16,14.48 37.21,17.53 37.21,34.04 38.1,34.92 U11.26
N$25
  Top 0.254: U11.27 38.21,34.27 37.72,33.78 37.72,17.27 34.42,13.97 31.52,13.97 R33.1
N$26
  Top 0.254: U2.129 82.4,51.8 82.68,52.07 82.68,52.51 82.99,52.83 85.34,52.83 86.55,51.62 86.55,43.03 R12.1
N$27
  Top 0.254: R23.1 31.58,30.99 33.84,30.99 35.18,32.32 35.18,34.8 36.6,36.22 U11.24
N$28
  Top 0.254: R21.1 31.58,30.48 34.1,30.48 35.69,32.07 35.69,34.54 36.71,35.57 U11.25
N$29
  Top 0.254: R26.1 29.66,28.51 29.25,28.92 R21.2 29.25,29.86 C64.1 27.62,28.89 28,28.51 R22.1
N$30
  Top 0.254: U8.4 19.5,59.25 19.81,59.56 22.39,59.56 R53.1 | R53.1 R56.2 | R53.1 24.49,58.97 C111.2
N$31  (via drill 0.3 pad 0.6)
  Top 0.254: U2.15 72.81,57.3 v72.84,57.21 | R16.1 96.84,35.81 97.22,36.2 97.22,42.1 94.23,45.09 94.23,47.56 95.82,49.15 X2.8 95.76,49.15 93.09,51.82 v92.65,51.82
  Bottom 0.254: v72.84,57.21 72.84,55.56 74.99,53.4 91.06,53.4 v92.65,51.82
N$32
  Top 0.254: R23.2 29.25,31.61 C64.2 27.58,31.57 R24.1 25.96,31.62 R28.1
N$33
  Top 0.254: R22.2 C63.1 27.26,23.18 26.23,23.18 26.03,22.98 U3.3
N$34
  Top 0.254: C67.1 26,29.84 R24.2 26.99,28.9 26.99,24.89 26.55,24.45 U3.4
N$35
  Top 0.254: R28.2 22.68,31.6 C67.2 21.02,28.18 C65.+ 21.02,27.12 22.86,25.27 22.86,22.67 23.38,22.15 U3.1
N$36
  Top 0.254: U11.11 47.17,40.12 48.58,41.53 48.58,47.12 50.76,49.3 51.24,49.3 | 51.24,49.3 U2.57 | 51.24,49.3 51.24,49.09 | 51.24,49.09 51.24,47.97 R61.1 | 51.24,49.09 51.43,49.28 | 51.24,49.09 51.05,49.28
N$37
  Top 0.254: R58.2 30.96,62.18 C116.2 33.07,62.8 34.61,62.8 36.39,61.02 36.39,41.53 37.14,40.77 U11.17
N$38
  Top 0.254: R72.1 R67.1 24.62,44.07 C130.1 23.01,44.18 R71.2 21.44,44.16
  Top 0.508: 21.44,44.16 U13.1
N$39
  Top 0.254: 20.89,23.11 21.02,23.24 C65.- | C65.- R25.2 | IC1.5 18.73,21.78 19.05,22.1 19.62,22.1 21.02,23.49 C65.-
N$40
  Top 0.254: U2.56 52.9,49.8 | 52.9,49.8 50.49,49.8 48.07,47.37 48.07,41.78 47.06,40.77 U11.12 | 52.83,51.21 R62.1 52.9,51.22 52.9,50.04 | 52.9,49.8 52.9,50.04 | 52.9,50.04 52.7,49.85 | 52.9,50.04 53.09,49.85
N$41
  Top 0.254: R52.2 R47.1 arc90 17.92,60.67 19.45,60.67
  Top 0.508: 19.45,60.67 U8.3
N$42
  Top 0.254: C130.2 24.49,42.46 R71.1 | U13.4 19.5,42.74 19.81,43.05 22.39,43.05 R71.1 | R71.1 R74.2
  Top 0.508: R71.1 22.95,42.46
N$43
  Top 0.254: R50.2 27.71,62.83 28.82,63.93 C116.1 33.07,63.31 34.86,63.31 36.89,61.28 36.89,41.78 37.26,41.42 U11.16
N$44  (via drill 0.3 pad 0.6)
  Top 0.254: U10.3 30.03,57.21 29.72,56.9 29.72,54.8 | U15.3 30.03,40.7 29.72,40.39 v29.72,38.16 29.27,37.72 23.11,37.72 | U12.4 42.29,52.39 42.61,52.7 43.88,52.7 44.19,53.02 U12.1 v44.19,54.86 v44.2,54.86 | 23.11,37.72 22.48,37.72 21.72,36.96 19.24,36.96 17.91,38.29 R69.1 | R74.1 22.99,37.85 23.11,37.72 | 29.72,54.8 29.15,54.23 23.18,54.23 | 23.18,54.23 22.54,54.23 21.84,53.53 19.18,53.53 17.91,54.8 R52.1 | R56.1 22.99,54.42 23.18,54.23 | v29.66,54.8 29.72,54.8
  Top 0.508: U12.1 44.19,54.04
  Bottom 1.016: 31.88,51.62 32.38,52.07 | 32.38,52.07 32.89,52.58 | 32.89,52.58 38.8,58.48 41.08,58.48 44.2,55.37 v44.2,54.86 | v29.66,54.8 31.88,52.58 | 31.88,52.58 32.38,52.07 | 31.88,51.62 31.88,52.58 | 31.88,52.58 32.89,52.58 | 31.88,51.62 31.88,43.88 33.4,42.35 33.4,39.18 32.38,38.16 v29.72,38.16
N$45
  Top 0.508: U4.1 63.06,5.16 C80.1
N$46
  Top 0.254: U10.1 32.13,55.31 32.77,55.94 32.77,57.3 R55.2 30.97,59.14 C112.2 30.86,60.64 29.34,62.17 R58.1
N$47
  Top 0.508: U4.6 63.06,6.91 C80.2 | D1.1 C80.2 | C80.2 60.04,6.91 L8.P$1
N$48
  Top 0.254: R55.1 29.25,57.76 28.7,57.21 U10.4 | C112.1 29.25,60.62 R55.1 | R54.2 R55.1
N$49
  Top 0.508: C81.1 78.81,5.22 U5.1
N$50
  Top 0.508: R31.1 65.74,5.18 U4.3 65.34,4.7 65.34,4.44 65.98,3.81 66.59,3.81 R35.2
N$51
  Top 0.254: U2.43 51.15,56.3 | U11.14 46.83,42.07 47.05,42.29 47.05,53.15 50.2,56.3 51.15,56.3 | R64.1 arc90 51.18,57.49 51.18,56.52 | 51.18,56.52 51.18,56.32 51.15,56.3 | 51.18,56.52 50.99,56.32 | 51.18,56.52 51.37,56.32
N$52
  Top 0.254: U11.13 46.95,41.42 47.56,42.04 47.56,52.89 50.46,55.8 52.96,55.8 | 52.96,55.8 U2.44 | R63.1 arc90 52.96,54.46 52.96,55.56 | 52.96,55.56 52.96,55.8 | 52.96,55.56 53.15,55.75 | 52.96,55.56 52.77,55.75
N$53
  Top 0.254: U11.3 47.63,34.92 49.78,32.77 54.23,32.77 56.07,34.61 56.07,45.54 56.82,46.29 59.18,46.29 59.68,45.8 U2.64
N$54
  Top 0.254: U2.60 56.75,47.8 55.05,46.1 55.05,35.12 53.72,33.78 50.29,33.78 47.85,36.22 U11.5
N$55
  Top 0.254: U2.62 56.51,46.8 55.56,45.85 55.56,34.86 53.97,33.27 50.04,33.27 47.74,35.57 U11.4
N$56
  Top 0.254: U16.3 47.2,61.3 R76.1
N$57
  Top 0.254: U2.58 56.22,48.8 54.04,46.61 54.04,35.62 53.21,34.8 50.8,34.8 48.08,37.52 U11.7
N$58
  Top 0.254: U2.59 56.49,48.3 54.55,46.35 54.55,35.37 53.47,34.29 50.55,34.29 47.96,36.87 U11.6
N$59  (via drill 0.3 pad 0.6)
  Top 0.254: U1.42 64.84,20.51 v66.67,22.35
  Bottom 0.254: X1.C2 73.98,29.65 v66.67,22.35
N$60
  Top 0.508: D2.1 C81.2 | C81.2 78.81,6.97 U5.6 | C81.2 75.79,6.97 L9.P$1
N$61
  Top 0.254: U2.27 66.81,62.11 67.31,62.61 67.31,65.09 66.1,66.29 56.39,66.29 54.74,64.64 R70.2
N$62
  Top 0.508: R32.1 81.49,5.25 U5.3 81.09,4.32 81.73,3.68 R36.2
N$63  (via drill 0.3 pad 0.6)
  Top 0.254: U2.18 71.31,59.69 v71.5,59.5 | X2.1 v92.65,56.77 95.97,60.09 R20.2
  Bottom 0.254: v71.5,59.5 73.15,59.5 74.55,58.1 74.55,56.13 75.76,54.93 90.81,54.93 v92.65,56.77
N$64
  Top 0.254: U2.126 82.48,50.3 82.68,50.1 85.34,50.1 86.04,49.4 86.04,42.8 88.45,40.39 88.45,38.29 89.28,37.46 R19.2
N$65  (via drill 0.3 pad 0.6)
  Top 0.305: 79.23,38.29 C32.1 79.31,38.34 U2.107 | 58.8,42.3 C35.1 U2.71 | U2.143 83.32,58.8 C38.1 83.31,58.79 | U2.2 79.31,62.31 C33.1 79.68,62.8 | U2.35 62.81,62.57 C36.1 63.31,62.57 U2.34
  Top 0.508: v61.85,62.8 C36.1 | v80.39,62.8 79.33,62.8 C33.1 | v83.31,60.13 83.31,59.13 C38.1 | v80.33,38.29 C32.1 | v58.8,41.15 58.8,42.28 C35.1
  Top 1.016: v78.36,59.12 v78.36,42.86 v69.91,42.86 v63.75,42.86 v63.75,59.63
  Bottom 0.305: 58.8,42.3 C35.1 | 83.31,58.79 C38.1
  Bottom 0.508: L3.1 v69.91,42.86 C39.1 69.91,43.12 | v63.75,42.86 61.91,42.86 61.34,42.29 C35.1 58.8,42.28 v58.8,41.15 | v80.39,62.8 79.64,62.8 C33.1 78.36,61.86 v78.36,59.12 C38.1 83.31,59.13 v83.31,60.13 | v80.33,38.29 79.23,38.29 C32.1 79.25,40.13 78.36,41.02 v78.36,42.86 | v61.85,62.8 C36.1 63.05,60.32 v63.75,59.63
N$66  (via drill 0.3 pad 0.6)
  Top 0.254: U2.16 72.31,58.27 v72.14,58.1 | X2.5 91.38,51.69 v92.65,52.96 93.54,53.85 93.54,56.52 97.28,60.26 97.28,64.45 96.9,64.83 R17.1
  Bottom 0.254: v72.14,58.1 73.03,58.1 73.53,57.59 73.53,55.63 75.25,53.91 91.69,53.91 v92.65,52.96
N$67  (via drill 0.3 pad 0.6)
  Top 0.254: U2.19 70.81,59.12 71.38,58.54 v71.38,56.27 | R18.1 95.97,41.19 90.55,46.61 | v92.65,49.91 92.65,48.7 90.55,46.61 | 90.55,46.61 X2.9
  Bottom 0.254: v71.38,56.27 74.75,52.89 89.66,52.89 v92.65,49.91
N$68  (via drill 0.3 pad 0.6)
  Top 0.254: U2.82 66.81,38.79 C11.1 | U2.94 72.81,38.82 C15.1
  Top 0.305: U2.103 77.31,38.62 C8.1 | U2.67 59.13,44.3 C14.1 | 58.8,53.35 C12.1 | 58.83,53.3 C12.1 | 58.8,57.8 C10.1 58.8,57.8 U2.40 | U2.139 83.05,56.8 C7.1 83.31,57.2 | C6.1 83.31,51.3 U2.128 | 83.31,51.32 C6.1 | U2.117 83.02,45.8 C13.1 | C4.1 64.81,62.78 | 64.81,62.78 U2.31 | 64.81,62.78 64.83,62.8 | C9.1 68.81,62.79 U2.23 | U2.9 75.81,62.8 C5.1 | U2.49 59.15,53.3 C12.1 | 83.31,51.23 C6.1
  Top 0.508: v65.91,62.8 64.78,62.8 C4.1 | v69.98,62.8 68.85,62.8 C9.1 | v74.68,62.8 75.81,62.8 C5.1 | v83.31,58.1 83.31,57.16 C7.1 | v83.31,52.13 83.31,51.07 C6.1 | v83.31,47.24 83.31,46.12 C13.1 | v75.82,38.29 76.95,38.29 C8.1 | v72.14,37.15 72.14,38.15 C15.1 | v66.17,37.08 66.17,38.15 C11.1 | v58.8,45.66 58.8,44.65 C14.1 | v58.8,54.8 C12.1 | v58.8,59.18 58.8,58.05 C10.1
  Top 1.016: v68.83,59.63 v65.09,59.63 v65.09,58.04 v65.09,53.66 v65.09,46.23 65.09,44.26 v66.17,44.26 v68.33,44.26 v72.14,44.26 v76.96,44.26 77.03,44.26 v77.03,46.1 v77.03,51.05 v77.03,57.15 77.03,58.42 v75.82,59.63
  Bottom 0.254: C28.1 v68.33,44.26
  Bottom 0.305: 58.8,53.35 C12.1 | 58.8,44.65 C14.1 | 58.8,57.8 C10.1 | C6.1 83.31,51.32 | 83.31,57.26 C7.1 | C9.1
  Bottom 0.508: L1.1 v68.33,44.26 | v77.03,57.15 C7.1 83.31,57.16 v83.31,58.1 | v77.03,51.05 C6.1 83.31,51.04 v83.31,52.13 | v77.03,46.1 C13.1 83.31,46.12 v83.31,47.24 | v76.96,44.26 C8.1 76.95,38.29 v75.82,38.29 | v65.09,53.66 C12.1 v58.8,54.8 | v65.09,58.04 C10.1 58.8,58.05 v58.8,59.18 | v68.83,59.63 C9.1 68.85,62.8 v69.98,62.8 | v75.82,59.63 C5.1 75.81,62.8 v74.68,62.8 | v58.8,45.66 58.8,44.63 C14.1 60.45,44.64 60.83,45.02 63.88,45.02 v65.09,46.23 | v65.91,62.8 64.78,62.8 C4.1 64.77,59.94 v65.09,59.63 | v66.17,44.26 66.17,38.18 C11.1 66.17,38.15 v66.17,37.08 | v72.14,44.26 72.14,38.18 C15.1 72.14,38.15 v72.14,37.15
N$69  (via drill 0.3 pad 0.6)
  Top 0.254: U2.20 70.31,58.43 v70.29,58.42 | X2.3 91.76,54.23 v92.65,55.12
  Bottom 0.254: v70.29,58.42 70.67,58.8 73.09,58.8 74.04,57.85 74.04,55.88 75.5,54.42 91.95,54.42 v92.65,55.12
N$70
  Top 0.61: X6.P$1 89.73,4.06 89.04,3.38 Q1.3
N$71  (via drill 0.3 pad 0.6)
  Top 0.254: v66.74,20.32 65.34,18.92 U1.43
  Bottom 0.254: X1.C1 74.36,23.43 69.85,23.43 v66.74,20.32
N$72
  Top 0.254: U1.5 69.77,21.73 69.98,21.53 69.68,21.23 U1.4
  Top 0.406: L7.1 C58.1 C57.1 70.66,19.45 70.29,19.81 70.29,21.21 69.98,21.53
N$73
  Top 0.254: LED1.C 84.77,40.58 83.05,42.3 U2.110
N$74
  Top 0.254: U1.6 70.16,22.23
  Top 0.406: 70.16,22.23 70.93,21.46 70.93,20.32 71.5,19.75 71.9,19.75 C59.1 C60.1 72.64,17.41 72.64,17.4 73.74,16.3 L7.2 L6.1
N$75
  Top 0.254: R7.1 76.24,16.29 76.52,16.57 X1.A1
N$76  (via drill 0.3 pad 0.6)
  Top 0.254: C61.1 59.43,22.23 U1.31 v61.79,22.22
  Top 0.406: L6.2 v71.56,14.86
  Bottom 0.508: v61.79,22.22 62.55,22.22 66.04,18.73 67.69,18.73 v71.56,14.86
N$77
  Top 0.254: R8.1 78.65,29.25 X1.A2
N$78
  Top 0.254: U1.11 78.07,24.73 79.44,26.1 X1.3
  Bottom 0.254: X1.3 85.41,26.1 86.21,25.3 R2.2
N$79
  Top 0.254: U1.12 77.81,25.23 81.22,28.64 X1.1
  Bottom 0.254: X1.1 84.84,28.64 85.73,27.75 85.73,27.73 R1.2
N$80
  Top 0.254: U1.10 79.47,24.23 80.07,24.83 X1.4
  Bottom 0.254: X1.4 84.71,24.83 85.73,23.81 85.73,23.79 R3.2
N$81
  Top 0.254: U1.9 79.08,23.73 80.52,22.29 X1.6
  Bottom 0.254: X1.6 85.28,22.29 86.21,21.36 R4.2
N$82
  Bottom 0.254: R1.1 87.91,27.22 88.39,26.73 88.9,26.73 88.96,26.67 88.98,26.67 C1.2 88.98,25.78 88.39,25.78 87.91,25.3 R2.1
N$83
  Bottom 0.254: R3.1 87.91,23.28 88.39,22.8 88.91,22.8 C2.2 88.98,21.84 88.39,21.84 87.91,21.36 R4.1
N$84
  Top 0.254: LED1.A R65.1
N$85  (via drill 0.3 pad 0.6)
  Top 0.254: U1.8 69.73,23.23 69.98,22.99 69.72,22.73 U1.7 | v82.68,15.88 C3.1 L4.1 | C42.2
  Top 0.406: C42.2 72.28,21.28 C43.2 72.21,22.99 69.98,22.99
  Bottom 0.254: X1.2 80.77,27.37 80.07,26.67 80.07,24.83 X1.5
  Bottom 1.016: 80.14,16.64 81.92,16.64 v82.68,15.88 80.65,17.91 | 80.14,16.64 76.65,16.64 C42.2 | 80.65,17.91 79.31,19.24 79.31,21.53 X1.5 | 80.14,16.64 80.9,17.4 | 80.65,17.21 80.65,17.91
  other vias: 72.14,21.15
N$86
  Top 0.508: R59.1 88.8,8.17 89.05,7.92 D3.2 89.05,6.43 88.9,6.28 Q1.1
N$87
  Top 0.254: U1.15 66.84,27.4 67.18,27.75 69.75,27.75 74.74,32.74 R10.1
N$88
  Top 0.254: 60.42,20.73 U1.34 57.44,20.73 56.58,21.59 56.58,32.07 61.15,36.64 63.37,36.64 64.31,37.57 U2.77
N$89
  Top 0.254: U1.35 57.24,20.23 56.07,21.4 56.07,32.32 60.9,37.15 63.12,37.15 63.81,37.84 U2.76
N$90
  Top 0.254: U1.36 57.04,19.73 55.56,21.21 55.56,32.57 60.64,37.66 62.86,37.66 63.31,38.1 U2.75
N$91
  Top 0.254: 69.81,39.79 U2.88 69.81,35.83 68.07,34.1 64.9,34.1 63.34,32.54 U1.22
N$92
  Top 0.254: 69.31,39.79 U2.87 69.31,36.03 67.88,34.61 63.95,34.61 62.38,33.05 R9.2 62.38,30.9 62.84,30.44 U1.23
N$93
  Top 0.254: U1.27 59.15,24.23 58.1,25.27 58.1,30.54 58.1,31.12 58.1,31.37 61.85,35.12 67.69,35.12 68.81,36.23 U2.86
N$94
  Top 0.254: U1.29 58.75,23.23 57.09,24.89 57.09,31.88 61.34,36.13 63.63,36.13 64.81,37.31 U2.78
N$95
  Top 0.254: U2.98 74.81,36.54 R10.2
N$96
  Top 0.254: U1.40 63.84,16.72 R6.1
N$97
  Top 0.254: U1.19 64.84,27.3 63.83,28.31 63.83,32.33 65.09,33.59 66.23,33.59 66.61,33.59 68.33,33.59 70.31,35.57 U2.89
N$98
  Top 0.254: U1.18 65.34,27.5 64.33,28.51 64.33,32.07 65.34,33.08 R5.1 69.95,34.46 70.81,35.31 U2.90
N$99
  Top 0.254: U1.28 58.95,23.73 57.59,25.08 57.59,31.62 61.59,35.62 63.88,35.62 65.31,37.05 U2.79
N$100
  Top 0.254: U2.74 62.81,38.36 62.61,38.16 60.39,38.16 55.05,32.83 55.05,21.02 56.83,19.24 59.56,19.24 63.18,15.62 66.48,15.62 67.34,16.47 U1.47
N$101
  Top 0.254: U1.16 R15.2 66.31,29.36 C62.2
N$102
  Top 0.254: U2.29 65.81,61.87 66.8,62.87 66.8,64.83 65.85,65.79 59.56,65.79 55.05,61.28 R76.2
N$103
  Top 0.254: IC1.3 17.46,13.59 18.35,12.7 19.94,12.7 20.77,11.87 20.77,11.32 C96.- R39.2
N$104
  Top 0.254: IC1.6 17.46,22.05 C82.1 17.72,22.3 R29.2 R30.2
N$105
  Top 0.254: IC1.7 16.19,22.05 C82.2 14.16,22.29 13.05,23.4 | 13.02,24.83 12.95,24.77 C66.+ 12.95,23.49 13.05,23.4 | R30.1 14.06,25.55 13.05,24.54 13.05,23.4
N$106
  Top 0.254: R27.2 C66.- 12.95,27.05 11.68,25.78 X3.S1
N$107
  Bottom 1.016: 22.23,37.85 22.67,38.29
N$108
  Top 0.254: R43.2 R44.2 16.19,12.52 C101.1 16.19,13 IC1.2
N$109
  Top 0.254: 13.02,10.29 12.95,10.35 C97.+ | C97.+ 12.95,11.87 13.02,11.94 13.86,11.94 C101.2 14.92,13 IC1.1 | R44.1 14.06,9.5 12.95,10.6 C97.+
N$110
  Bottom 1.016: 55.24,25.65 56.58,25.65
N$111
  Top 0.254: U9.18 47.41,6.1 R45.1 R46.2
N$112
  Top 0.254: U9.2 48.06,14.85 48.31,15.1 C113.2
N$113
  Top 0.254: U9.3 47.41,13.49 47.82,13.08 49.64,13.08 C113.1
N$114
  Top 0.254: U9.10 42.86,13.46 42.54,13.14 41.91,13.14 41.66,12.89 C108.2
N$115
  Top 0.254: U9.12 43.51,8.94 43.24,9.21 41.97,9.21 41.66,9.52 C108.1
N$116
  Top 0.508: U7.1 42.25,25.88 C105.1
N$117
  Top 0.254: U9.9 43.51,14.59 43.05,15.05 42.4,15.05 C122.2
N$118
  Top 0.254: U9.13 44.16,8.92 44.51,9.27 48.97,9.27 C117.2 49.84,8.26 U9.20
N$119
  Top 0.254: U9.14 44.81,7.32 R57.2
N$120
  Top 0.254: R47.2 14.67,62.38 arc-90 C107.+
N$121
  Top 0.254: U9.17 46.76,5.21 C114.1
N$122
  Top 0.254: R49.2 R48.1 44.81,16.68 U9.7
N$123
  Top 0.254: R66.2 14.67,45.87 arc-90 C128.+
N$124  (via drill 0.3 pad 0.6)
  Top 0.254: U2.121 82.72,47.8 83.06,48.13 v84.71,48.13 | v88.65,35.88 88.71,35.81 R11.1
  Bottom 0.254: v84.71,48.13 85.92,48.13 86.3,47.75 86.3,38.23 v88.65,35.88
N$125
  Top 0.508: 65.66,59.37 65.34,59.05
N$126
  Top 0.508: 63.95,43.5 64.39,43.05
N$127
  Top 0.508: 62.67,42.04 62.99,41.72
N$128
  Top 0.508: 77.72,43.05 78.11,43.43
N$129
  Top 0.508: 79.06,41.66 79.5,42.1
V_COM
  Top 0.254: U11.15 40.53,42.57 41.03,43.06 C124.2 C123.2 41.03,47.11 40.77,47.37 R60.2
V_IN  (via drill 0.3 pad 0.6)
  Top 0.508: U4.4 U4.5 64.39,8.38 C90.1 v63.5,8.95 | U5.4 U5.5 80.14,8.32 79.88,8.57 v79.88,9.02 79.88,9.33 C91.1 | 86.11,7.24 v85.79,7.56 v85.79,6.92 86.11,7.24 | 86.11,7.24 D3.1
  Top 0.61: D3.1 86.85,6.43 87,6.28 Q1.2
  Bottom 1.016: v85.79,6.92 v85.79,7.56 85.79,6.41 85.34,5.97 83.38,5.97 80.33,9.02 v79.88,9.02 | v63.5,8.95 v64.14,8.95 66.42,6.67 76.52,6.67 78.87,9.02 v79.25,9.02 v79.88,9.02 | v79.88,9.02 C91.1
VCC  (via drill 0.3)
  Top 0.254: U9.5 U9.4 46.76,15.34 C100.2 | U9.15 v45.47,6.54
  Top 0.508: L8.P$2 56.54,9.33 C93.1 56.51,9.84 56.51,10.73 57.66,11.87 65.53,11.87 67.82,9.59 67.82,7.9 R31.2 | v49.21,21.84 49.21,22.91 C103.1 49.19,22.88 U7.4 U7.3 | v48.39,15.88 47.32,15.88 C100.2
  Top 0.61: v55.05,9.97 56.38,9.97 56.51,9.84 | v55.05,8.7 56.51,8.7 C93.1 | v55.05,9.97 v55.05,9.33 | v55.05,9.97 v55.05,8.7 | v55.05,8.7 55.5,8.7 55.5,9.84
  Bottom 0.254: v48.39,15.88 48.39,15.89
  Bottom 0.508: 54.36,10.98 53.09,10.98 48.64,6.54 v45.47,6.54 | 54.36,10.98 54.99,10.98 55.05,11.05 | 54.36,10.98 54.8,11.43 | 54.36,10.98 54.8,10.54
  Bottom 1.016: v48.39,15.88 48.39,14.86 49.4,13.84 53.4,13.84 55.05,12.19 55.05,11.05 v55.05,9.97 v55.05,8.7 | 48.39,15.89 48.39,21.02 v49.21,21.84

## Text on the board
Top: I1 | I2 | O1 | O2
Bottom: Audio Interface | 09.2018 | V2.0